# EAGLE schematic dual-led-wireless-dimmer (EAGLE 8.6.0)
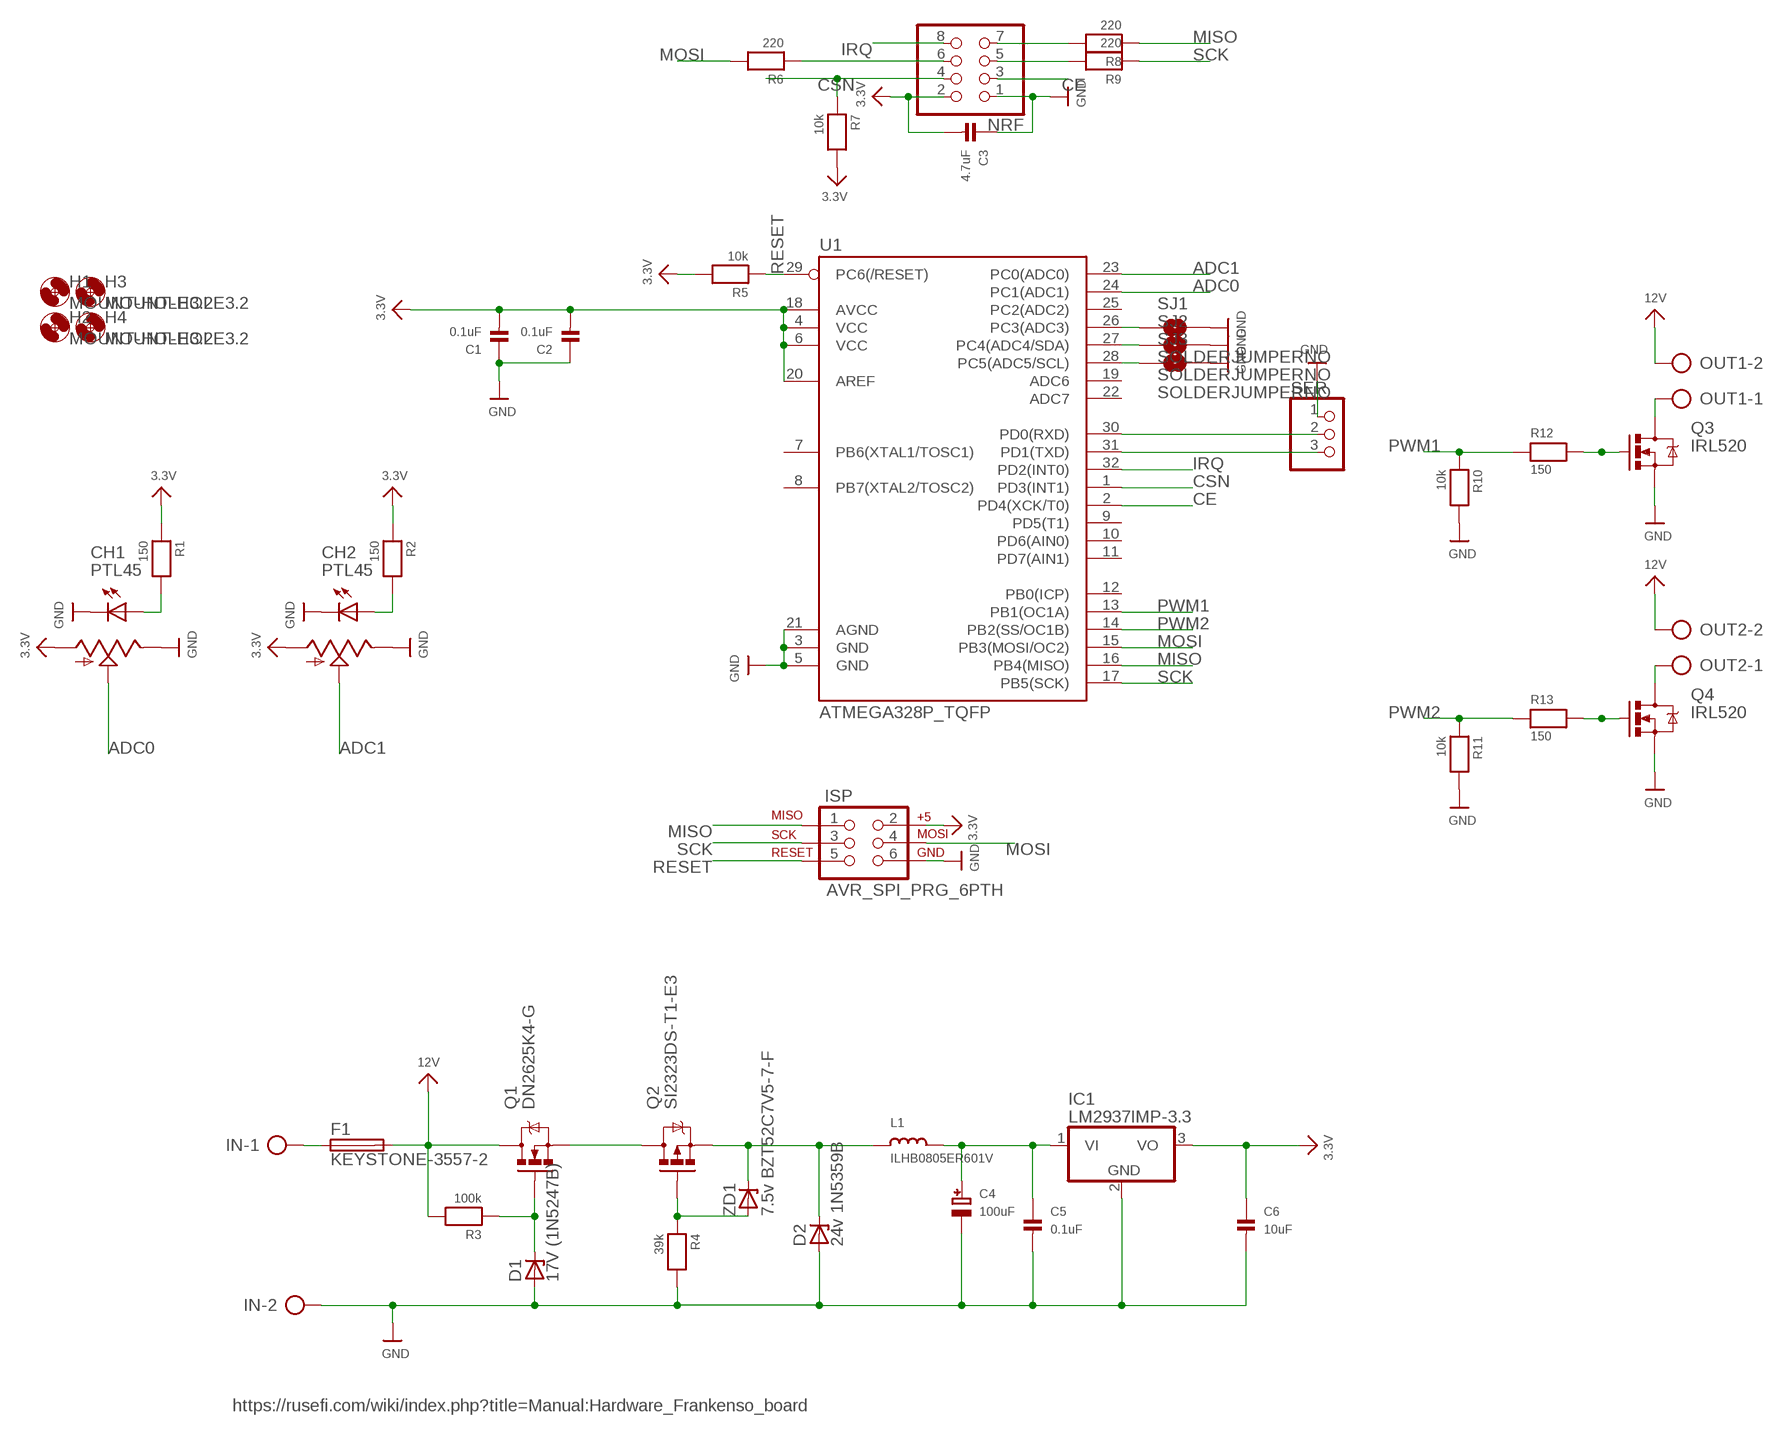
[diagram p0: schematic, sheet 1]

## Parts
C1  0.1uF  CAP_CERAMIC0805  [0805]
C2  0.1uF  CAP_CERAMIC0805  [0805]
C3  4.7uF  CAP_CERAMIC0805  [0805]
C4  100uF  CAP_ELECTROLYTICPANASONIC_D  [PANASONIC_D]
C5  0.1uF  CAP_CERAMIC0805  [0805]
C6  10uF  CAP_CERAMIC0805  [0805]
CH1  PTL45  [BOURNS-PTL45]
CH2  PTL45  [BOURNS-PTL45]
D1  17V (1N5247B)  ZENER-DIODEZD-5  [ZDIO-5]
D2  24v 1N5359B  ZPY  [DO41Z10]
F1  KEYSTONE-3557-2  [KEYSTONE-3557-2]
H1  MOUNT-HOLE3.2  [3,2]
H2  MOUNT-HOLE3.2  [3,2]
H3  MOUNT-HOLE3.2  [3,2]
H4  MOUNT-HOLE3.2  [3,2]
IC1  LM2937IMP-3.3  LM2937  [TO263-3]
IN  AK500/2-H  [AK500/2-H]
ISP  AVR_SPI_PRG_6PTH  [2X3]
L1  ILHB0805ER601V  INDUCTOR0805  [0805]
NRF  PINHD-2X4  [2X04]
OUT1  AK500/2-H  [AK500/2-H]
OUT2  AK500/2-H  [AK500/2-H]
Q1  DN2625K4-G  MOSFET-NCHANNELFDD8780  [DPAK]
Q2  SI2323DS-T1-E3  MOSFET-PCHANNEL  [SOT23-3]
Q3  IRL520  MOSFET-NCHANNELFQP30N06L  [TO220V]
Q4  IRL520  MOSFET-NCHANNELFQP30N06L  [TO220V]
R1  150  RESISTOR0805  [0805]
R2  150  RESISTOR0805  [0805]
R3  100k  RESISTOR0805  [0805]
R4  39k  RESISTOR0805  [0805]
R5  10k  RESISTOR0805  [0805]
R6  220  RESISTOR0805  [0805]
R7  10k  RESISTOR0805  [0805]
R8  220  RESISTOR0805  [0805]
R9  220  RESISTOR0805  [0805]
R10  10k  RESISTOR0805  [0805]
R11  10k  RESISTOR0805  [0805]
R12  150  RESISTOR0805  [0805]
R13  150  RESISTOR0805  [0805]
SER  PINHD-1X3  [1X03]
SJ1  SOLDERJUMPERNO  [SJ_2S-NO]
SJ2  SOLDERJUMPERNO  [SJ_2S-NO]
SJ3  SOLDERJUMPERNO  [SJ_2S-NO]
U1  ATMEGA328P_TQFP  [TQFP32-08]
ZD1  7.5v BZT52C7V5-7-F  ZD-SOD123  [SOD123]

## Nets
3.3V: C1.2 C2.2 C3.2 C6.1 CH1.1(A) CH2.1(A) IC1.3(VO) ISP.2 NRF.2 R1.1 R2.1 R5.2 R7.2 U1.4(VCC) U1.6(VCC) U1.18(AVCC) U1.20(AREF)
12V: F1.R1 F1.R2 OUT1.2 OUT2.2 Q1.4(D) R3.2
ADC0: CH1.2(S) U1.24(PC1(ADC1))
ADC1: CH2.2(S) U1.23(PC0(ADC0))
CE: NRF.3 U1.2(PD4(XCK/T0))
CSN: NRF.4 R7.1 U1.1(PD3(INT1))
GND: C1.1 C2.1 C3.1 C4.- C5.2 C6.2 CH1.3(E) CH1.E(LED-) CH2.3(E) CH2.E(LED-) D1.A D2.A IC1.2(GND) IN.2 ISP.6 NRF.1 Q3.3(S) Q4.3(S) R4.2 R10.2 R11.2 SER.1 SJ1.2 SJ2.2 SJ3.2 U1.3(GND) U1.5(GND) U1.21(AGND)
IRQ: NRF.8 U1.32(PD2(INT0))
MISO: ISP.1 R8.1 U1.16(PB4(MISO))
MOSI: ISP.4 R6.2 U1.15(PB3(MOSI/OC2))
N$1: Q3.1(G) R12.2
N$2: Q4.1(G) R13.2
N$3: CH1.B(LED+) R1.2
N$4: CH2.B(LED+) R2.2
N$5: F1.L1 F1.L2 IN.1
N$6: OUT1.1 Q3.2(D)
N$7: NRF.6 R6.1
N$8: OUT2.1 Q4.2(D)
N$9: NRF.7 R8.2
N$10: SJ1.1 U1.26(PC3(ADC3))
N$11: D1.C Q1.1(G) R3.1
N$12: SJ2.1 U1.27(PC4(ADC4/SDA))
N$13: Q1.3(S) Q2.3(D)
N$14: Q2.1(G) R4.1 ZD1.A
N$15: D2.C L1.1 Q2.2(S) ZD1.C
N$16: SJ3.1 U1.28(PC5(ADC5/SCL))
N$17: C4.+ C5.1 IC1.1(VI) L1.2
N$19: SER.3 U1.31(PD1(TXD))
N$20: SER.2 U1.30(PD0(RXD))
N$66: NRF.5 R9.2
PWM1: R10.1 R12.1 U1.13(PB1(OC1A))
PWM2: R11.1 R13.1 U1.14(PB2(SS/OC1B))
RESET: ISP.5 R5.1 U1.29(PC6(/RESET))
SCK: ISP.3 R9.1 U1.17(PB5(SCK))
Unconnected: U1.7(PB6(XTAL1/TOSC1)) U1.8(PB7(XTAL2/TOSC2)) U1.9(PD5(T1)) U1.10(PD6(AIN0)) U1.11(PD7(AIN1)) U1.12(PB0(ICP)) U1.19(ADC6) U1.22(ADC7) U1.25(PC2(ADC2))

## Notes on the sheet
- https://rusefi.com/wiki/index.php?title=Manual:Hardware_Frankenso_board

## Library data of the parts
C1-C3 C5 C6 = microbuilder:CAP_CERAMIC: Ceramic Capacitors 0402 - 0402 Surface Mount Capacitors 16pF 50V 5% [Digikey: 445-4899-2-ND] 18pF 50V 5% [Digikey: 490-1281-2-ND] 22pF 50V 5% [Digikey: 490-1283-2-ND] 68pF 50V 5% [Digikey: 490-1289-2-ND] 0.1uF 10V 10% [Digikey: 490-1318-2-ND] 1.0uF 6.3V 10% [Digikey: 490-1320-2-ND] 0603 - 0603 Surface Mount Capacitors 16 pF 50V 5% [Digikey: 445-5051-2-ND] 22 pF 50V [Digikey: PCC220ACVTR-ND] 33 pF 50V 5% [Digikey: 490-1415-1-ND] 56pF 50V 5% [Digikey: 490-1421-1-ND] 220pF 50V 5% [Digikey: 445-1285-1-ND] 680 pF 50V 2200 pF 50V 5% C0G [Digikey: 445-1297-1-ND] 5600 pF 100V 5% X7R [Digikey: 478-3711-1-ND] 0.1 µF 25V 10% [Digikey: PCC2277TR-ND] 0.22 µF 16V 10% X7R [Digikey: 445-1318-1-ND] 1.0 µF 25V 10% [Digikey: 445-5146-2-ND] 0603 - RF Specific 3pF 250V +/-0.1pF RF [Digikey: 712-1347-1-ND] 18 pF 250V 5% [Digikey: 478-3505-1-ND or 712-1322-1-ND] 56 pF 250V 5% C0G RF [Digikey: 490-4867-1-ND] 68 pF 250V RF [Digikey: 490-4868-1-ND] 0805 - 0805 Surface Mount Capacitors 220 pF 250V 2% RF Ceramic Capacitor [Digikey: 712-1398-1-ND] 1000 pF 50V 2% NP0 Ceramic Capacitor [Digikey: 478-3760-1-ND] 0.1 µF 25V 10% Ceramic Capacitor [Digikey: PCC1828TR-ND] 1.0 µF 16V 10% Ceramic Capacitor[Digikey: 490-1691-2-ND] 10.0 µF 10V 10% Ceramic Capacitor[Digikey: 709-1228-1-ND] 10.0 uF 16V 10% Ceramic Capacitor [Digikey: 478-5165-2-ND] 47 uF 6.3V 20% Ceramic Capacitor [Digikey: 587-1779-1-ND or 399-5506-1-ND] 1206 - 1206 Surface Mount Capacitors 47uF 10V 20% Ceramic Capacitor [Digikey: 490-5528-1-ND or 399-5508-1-ND or 445-6010-1-ND] 100uF 6.3V -20%, +80% Y5V Ceramic Capacitor (Digikey: 490-4512-1-ND, Mouser: 81-GRM31CF50J107ZE1L)
C4 = microbuilder:CAP_ELECTROLYTIC: Electrolytic Capacitors SMT PANASONIC_C - Size C Panasonic Electrolytic Aluminum Capacitor 47µF 16V 20% Electrolytic Capacitor [Digikey: PCE3890TR-ND] PANASONIC_D - Size D Panasonic Electrolytic Aluminum Capacitor 100µF 25V 20% Electrolytic Capacitor [Digikey: PCE3898TR-ND] PTH 3.5 mm grid, 8 mm diameter ... 3.5 mm grid, 10 mm diameter ...
CH1 = keves-ng:PTL45; SPICEPREFIX: C
CH2 = keves-ng:PTL45
D1 = diode:ZENER-DIODE: Z-Diode
D2 = diode:ZPY: Z DIODE 1 W
F1 = keves-ng:KEYSTONE-3557-2: THM 2 in 1 Auto Blade Holder P/N 3557-2 Fuse Reference: Littelfuse ATO 257 series / Bussmann ATC series / APR / Littelfuse 891,897 series / Bussmann ATM-LP series / APS or equivalent http://www.keyelco.com/product.cfm/product_id/296
H1-H4 = holes:MOUNT-HOLE: MOUNTING HOLE with drill center marker
IC1 = linear:LM2937: LM2937-2.5, LM2937-3.3 400mA and 500mA Voltage Regulators Source: http://cache.national.com/ds/LM/LM2937-2.5.pdf
IN OUT1 OUT2 = con-ptr500:AK500/2-H: CONNECTOR Aug. 2004 / PTR Meßtechnik: Die Bezeichnung der Serie AK505 wurde geändert. Es handelt sich hierbei um AK500 in horizontaler Ausführung.; OC_FARNELL: unknown; OC_NEWARK: unknown
ISP = SparkFun-Connectors:AVR_SPI_PRG_6: AVR ISP 6 Pin This is the reduced ISP connector for AVR programming. Common on Arduino. This footprint will take up less PCB space and can be used with a 10-pin to 6-pin adapter such as SKU: BOB-08508 **Special note about "TEST_POINT" package. The stop mask is on the top side, so if you want your programming test points to be on the bottom of your board, make sure to place this package on the bottom side of the board. This also ensure that the orientation to program from the bottom side will be correct.
L1 = microbuilder:INDUCTOR: Inductors 0603: 10nH Ceramic Inductor - microwire antenna/RF (Digikey: 712-1434-2-ND) 0805: 560nH Ceramic Inductor - RF (Digikey: 553-1047-1-ND) 270nH Ceramic Inductor - Q = 40@250MHz, +-5%, 1 Ohm DC Resistance (Digikey: 535-10506-2-ND) 1007 (2518 Metric) SMT: 10µH 10% 250mOhm 820mA 1007 Inductor (Digikey: 587-2189-1-ND) 22µH 10% 500mOhm 580mA 1007 Inductor (Digikey: 587-2190-1-ND) 47µH 10% 950mOhm 420mA 1007 Inductor (Digikey: 587-2191-1-ND) 47µH 5% 100mOhm 1A 1008 Inductor (Digikey: 732-1816-1-ND) 5.0x5.0mm (Taiyo Yuden NR5040 Series) 6.8µH 20% 2.3A 64mOhm Inductor (Digikey: 587-2374-2-ND) 5.0x5.0mm (TDK VLC5045 Series) 4.7µH 20% 3.3A 34mOhm Inductor (Digikey: 445-6526-1-ND) 6.8µH 20% 2.7A 46mOhm Inductor (Digikey: 445-6527-1-ND) 6.0x6.0mm (TDK VLC6045 Series) 4.7µH 20% 3.8A 27mOhm Inductor (Digikey: 445-6538-2-ND) 6.8µH 20% 3A 41mOhm Inductor (Digikey: 445-6540-1-ND) 6.2µH 30% 2.2A 45mOhm Inductor (Digikey: SRR5028-6R2YCT-ND) - Not TDK VLC6045 but footprint should match 6.0x6.0mm (TDK SLF6045 Series) 6.8uH 30% 2A 33mOhm Inductor (Digikey: 445-4572-1-ND, Mouser: 810-SLF645T6R8N2R0PF)
NRF = pinhead:PINHD-2X4: PIN HEADER
Q1 = SparkFun-DiscreteSemi:MOSFET-NCHANNEL: Common NMOSFET Parts MFG P/N Store ID Prod ID FDD8780 TRANS-09984 SI7820DN TRANS-11055 FDS6630A IC-08089 2N7002PW TRANS-11151 FQP30N06L COM-10213 TRANS-10060 BSS123LT1G TRANS-08345 BSS138 TRANS-00830 BS170 2N7000; PROD_ID: TRANS-09984
Q2 = SparkFun-DiscreteSemi:MOSFET-PCHANNEL: Generic PMOSFET IRLML2244 - TRANS-11153 (SOT-23 -20V -4.3A) (1.Gate 2.Source 3.Drain) FQP27P06 - COM-10349 <http://www.sparkfun.com/products/10349> (TO-220 -60V -27A) (1.Gate 2.Source 3.Drain); PROD_ID: TRANS-08285
Q3 Q4 = keves-ng:MOSFET-NCHANNEL: Common NMOSFET Parts MFG P/N Store ID Prod ID FDD8780 TRANS-09984 SI7820DN TRANS-11055 FDS6630A IC-08089 2N7002PW TRANS-11151 FQP30N06L COM-10213 TRANS-10060 BSS123LT1G TRANS-08345 BSS138 TRANS-00830 BS170 2N7000; PROD_ID: TRANS-10060
R1-R13 = microbuilder:RESISTOR: Resistors 0402 - 0402 Surface Mount Package 22 Ohm 1% 1/16W [Digikey: 311-22.0LRTR-ND] 33 Ohm 5% 1/16W 1.0K 5% 1/16W 1.5K 5% 1/16W 2.0K 1% 1/16W 10.0K 1% 1/16W [Digikey: 311-10.0KLRTR-ND] 10.0K 5% 1/16W [Digikey: RMCF0402JT10K0TR-ND] 12.1K 1% 1/16W [Digikey: 311-22.0LRTR-ND] 100.0K 5% 1/16W 0603 - 0603 Surface Mount Package 0 Ohm 1/10 Watt 1% Resistor 15 Ohm 1/10 Watt 1% Resistor 33 Ohm 1/10 Watt 1% Resistor 49.9 Ohm 1/10 Watt 1% Resistor 100 Ohm 1/10 Watt 1% Resistor 150 Ohm 1/10 Watt 1% Resistor 240 Ohm 1/10 Watt 1% Resistor 390 Ohm 1/10 Watt 1% Resistor 560 Ohm 1/10 Watt 1% Resistor 680 Ohm 1/10 Watt 1% Resistor 750 Ohm 1/10 Watt 1% Resistor 1.0K Ohm 1/10 Watt 1% Resistor 1.5K Ohm 1/10 Watt 1% Resistor 2.0K Ohm 1/10 Watt 1% Resistor 2.2K Ohm 1/10 Watt 1% Resistor 3.3K Ohm 1/10 Watt 1% Resistor 4.7K Ohm 1/10 Watt 1% Resistor 10.0K Ohm 1/10 Watt 1% Resistor 12.0K Ohm 1/10 Watt 1% Resistor 12.1K Ohm 1/10 Watt 1% Resistor 20.0K Ohm 1/10 Watt 1% Resistor 33.0K Ohm 1/10 Watt 1% Resistor 100.0K Ohm 1/10 Watt 1% Resistor 0805 - 0805 Surface Mount Package 0 Ohm 1/8 Watt 1% Resistor 33 Ohm 1/8 Watt 1% Resistor 100 Ohm 1/8 Watt 1% Resistor 150 Ohm 1/8 Watt 1% Resistor 200 Ohm 1/8 Watt 1% Resistor 240 Ohm 1/8 Watt 1% Resistor 330 Ohm 1/8 Watt 1% Resistor 390 Ohm 1/8 Watt 1% Resistor 470 Ohm 1/8 Watt 1% Resistor 1.0K Ohm 1/8 Watt 1% Resistor 1.5K Ohm 1/8 Watt 1% Resistor 2.0K Ohm 1/8 Watt 1% Resistor 4.7K Ohm 1/8 Watt 1% Resistor 5.1K Ohm 1/8 Watt 1% Resistor 5.6K Ohm 1/8 Watt 1% Resistor 10.0K Ohm 1/8 Watt 1% Resistor 22.0K Ohm 1/8 Watt 1% Resistor 33.0K Ohm 1/8 Watt 1% Resistor 100K Ohm 1/8 Watt 1% Resistor 1206 - 1206 Surface Mount Package 2012 - 2010 Surface Mount Package 0.11 Ohm 1/2 Watt 1% Resistor - Digikey: RHM.11UCT-ND
SER = pinhead:PINHD-1X3: PIN HEADER
SJ1-SJ3 = SparkFun-Retired:SOLDERJUMPER: Solder Jumper Standard SMD solder jumper. Used to automate production. Two varients : Normally Open and Normally Closed are the same, but have different paste layers. NC will have a large amount of paste and should jumper during reflow.
U1 = SparkFun-DigitalIC:ATMEGA328P_TQFP; PROD_ID: IC-09069
ZD1 = diodes:ZD-: Zener diode

## Net classes
0 default: width 0.254 mm
1 3.3v: width 0.406 mm